# EAGLE design TRRSwithProMicro (EAGLE 9.1.0)
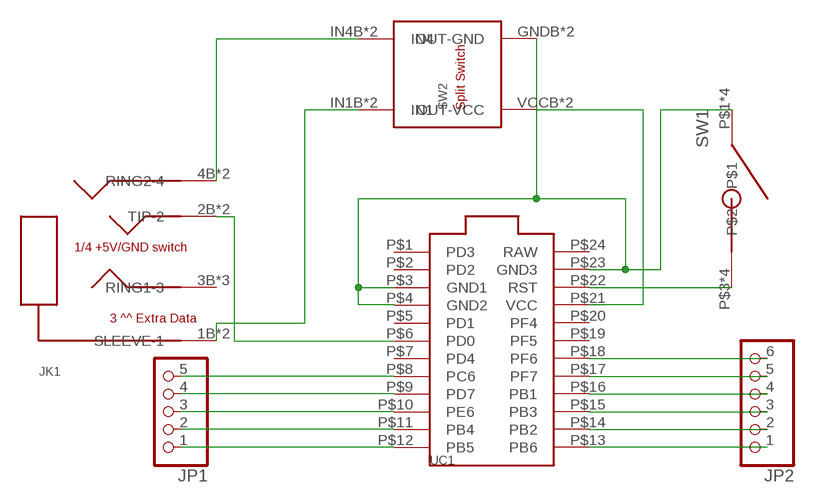
[diagram p0: schematic, sheet 1]

## Parts
JK1  TRRSJACKOVER  [TRRSJACK_OVER]
JP1  PINHD-1X5  [1X05]
JP2  PINHD-1X6  [1X06]
SW1  RSTSWSMD  [FLATSWT]
SW2  TRANSFERPADDY  [TRANSFER_PADS]
UC1  PROMICROTOP  [PROMICRO]

## Nets
N$1: JK1.1B(SLEEVE-1) JK1.1T(SLEEVE-1) SW2.IN1B(IN1) SW2.IN1T(IN1)
N$2: SW1.P$1 SW1.P$2 SW1.P$5 SW1.P$6 SW2.GNDB(OUT-GND) SW2.GNDT(OUT-GND) UC1.P$3(GND1) UC1.P$4(GND2) UC1.P$23(GND3)
N$3: JK1.2B(TIP-2) JK1.2T(TIP-2) UC1.P$6(PD0)
N$4: JK1.4B(RING2-4) JK1.4T(RING2-4) SW2.IN4B(IN4) SW2.IN4T(IN4)
N$5: SW1.P$3 SW1.P$4 SW1.P$7 SW1.P$8 UC1.P$22(RST)
N$6: JP1.1 UC1.P$12(PB5)
N$7: JP1.2 UC1.P$11(PB4)
N$8: JP1.3 UC1.P$10(PE6)
N$9: JP1.4 UC1.P$9(PD7)
N$10: JP2.1 UC1.P$13(PB6)
N$11: JP2.2 UC1.P$14(PB2)
N$12: JP2.3 UC1.P$15(PB3)
N$13: JP2.4 UC1.P$16(PB1)
N$14: JP2.5 UC1.P$17(PF7)
N$15: JP2.6 UC1.P$18(PF6)
N$16: JP1.5 UC1.P$8(PC6)
N$17: SW2.VCCB(OUT-VCC) SW2.VCCT(OUT-VCC) UC1.P$21(VCC)
Unconnected: JK1.3B(RING1-3) JK1.3T(RING1-3) JK1.EXTRA_DATA(RING1-3) UC1.P$1(PD3) UC1.P$2(PD2) UC1.P$5(PD1) UC1.P$7(PD4) UC1.P$19(PF5) UC1.P$20(PF4) UC1.P$24(RAW)

## Library data of the parts
JK1 = Keys:TRRSJACK
JP1 = pinhead:PINHD-1X5: PIN HEADER
JP2 = pinhead:PINHD-1X6: PIN HEADER
SW1 = Keys:RSTSW
SW2 = Keys:TRANSFER
UC1 = Keys:PROMICRO

## Board
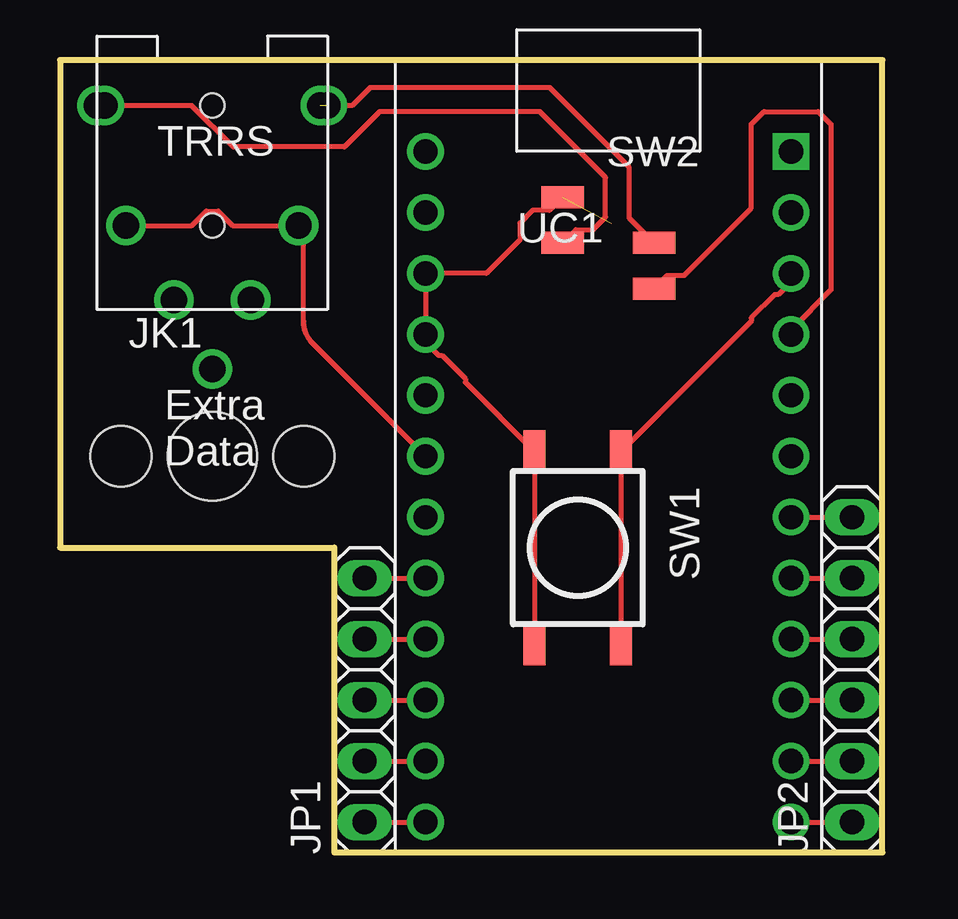
[diagram p1: board, top side]
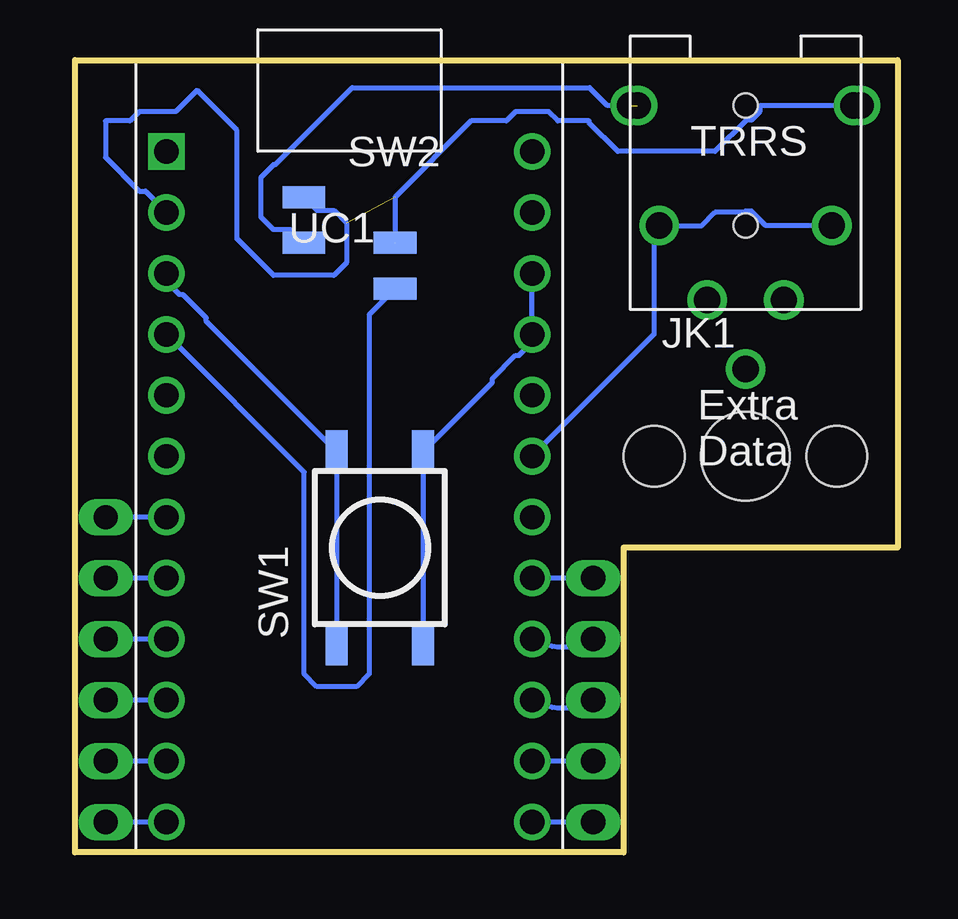
[diagram p2: board, bottom side, seen from below]

Size 34.29 x 33.02 mm. Coordinates in mm from the lower left corner, seen from the top.
Outline: 11.43,12.7 11.43,0 34.29,0 34.29,33.02 0,33.02 0,12.7 11.43,12.7
Copper layers (1*16): Top 0.035mm / dielectric 1.5mm / Bottom 0.035mm
Design rules "OthermillDRC_1_32_v2": minimum track width 8mil, minimum drill 0.8mm, track to track 0.794003125mm, track to pad 0.794003125mm, pad to pad 0.794003125mm, via to via 0.794003125mm, smd to smd 0mil, copper to edge 0mil, drill to drill 1mil, minimum pad ring 10mil, minimum via ring 10mil, stop-mask expansion 1mil, vias tented up to drill 30mil, thermal gap 10mil
Holes 3.71 mm at 6.35,16.51 -7.62,7.62
Holes 2.54 mm at 2.54,16.51 10.16,16.51

### Footprints (pad centres in the part's own frame; a part is rotated, then mirrored left to right if it is on the bottom)
TRRSJACK_OVER = drill 1.1: 1B 4.5,-1.9; 1T 4.8,-1.9; 2B 3.6,-6.9; 2T -3.6,-6.9; 3B -1.6,-10; 3T 1.6,-10; 4B -4.8,-1.9; 4T -4.5,-1.9; EXTRA_DATA 0,-12.87 | hole 1: 0,-1.9; 0,-6.9
1X05 = drill 1.016 long: 1 -5.08,0; 2 -2.54,0; 3 0,0; 4 2.54,0; 5 5.08,0
1X06 = drill 1.016 long: 1 -6.35,0; 2 -3.81,0; 3 -1.27,0; 4 1.27,0; 5 3.81,0; 6 6.35,0
FLATSWT = smd 1.778 x 0.914: P$1 -4,-1.8; P$2 4,-1.8; P$3 -4,1.8; P$4 4,1.8 | smd 1.778 x 0.914 bottom: P$5 -4,-1.8; P$6 4,-1.8; P$7 -4,1.8; P$8 4,1.8
TRANSFER_PADS = smd 1.778 x 0.914 bottom: GNDB -1.905,-1.905; IN1B -1.905,0; IN4B 1.905,0; VCCB 1.905,1.905 | smd 1.778 x 0.914: GNDT 1.905,-1.905; IN1T -1.905,0; IN4T 1.905,0; VCCT -1.905,1.905
PROMICRO = drill 1.016: P$1 -7.62,0; P$2 -7.62,-2.54; P$3 -7.62,-5.08; P$4 -7.62,-7.62; P$5 -7.62,-10.16; P$6 -7.62,-12.7; P$7 -7.62,-15.24; P$8 -7.62,-17.78; P$9 -7.62,-20.32; P$10 -7.62,-22.86; P$11 -7.62,-25.4; P$12 -7.62,-27.94; P$13 7.62,-27.94; P$14 7.62,-25.4; P$15 7.62,-22.86; P$16 7.62,-20.32; P$17 7.62,-17.78; P$18 7.62,-15.24; P$19 7.62,-12.7; P$20 7.62,-10.16; P$21 7.62,-7.62; P$22 7.62,-5.08; P$23 7.62,-2.54 | drill 1.016 square: P$24 7.62,0

### Placement (x,y rotation side)
JK1  6.35,33.02 0 top
JP1  12.7,6.35 90 top
JP2  33.02,7.62 90 top
SW1  21.59,12.7 270 top
SW2  22.86,25.4 180 top
UC1  22.86,29.21 0 top

### Tracks (layer width: path | path; a pad name or v marks a point on that pad's centre or on a via)
N$1  (1 unrouted)
  Top 0.203: SW2.IN1B 23.74,26.43 23.74,28.55 20.42,31.86 12.92,31.86 12.17,31.12 JK1.1T
  Bottom 0.203: SW2.IN1B 25.32,25.95 26.02,25.95 26.55,26.48 26.55,28.13 26.02,28.66 25.95,28.66 22.75,31.86 12.85,31.86 12.1,31.12 JK1.1T
N$2  (1 unrouted)
  Top 0.203: UC1.P$4 15.24,21.25 | 15.24,21.25 15.78,20.71 15.93,20.71 16.9,19.74 16.9,19.59 SW1.P$5 SW1.P$6 | SW2.GNDT 20.4,26.75 19.7,26.75 19.17,26.23 19.17,25.52 17.78,24.13 UC1.P$3 15.24,21.25
  Bottom 0.203: UC1.P$3 UC1.P$4 15.24,21.25 15.78,20.71 15.93,20.71 16.9,19.74 16.9,19.59 SW1.P$5 SW1.P$6 | SW2.GNDB 24.21,26.75 23.5,26.75 22.98,26.23 22.98,24.57 23.5,24.05 26.02,24.05 27.55,25.57 27.55,30.09 29.21,31.75 30.09,30.87 31.61,30.87 32,30.48 33.02,30.48 33.02,28.96 31.61,27.55 31.36,27.55 UC1.P$23
N$3
  Top 0.203: UC1.P$6 13.97,17.78 10.53,21.22 arc-45 10.16,22.12 10.16,25.61 arc45 JK1.2B 7.2,26.12 6.6,26.72 6.1,26.72 5.5,26.12 JK1.2T
  Bottom 0.203: 6.35,26.72 6.1,26.72 5.5,26.12 JK1.2T | UC1.P$6 13.97,17.78 10.16,21.59 10.16,25.91 JK1.2B 8.17,26.12 7.62,26.67 6.35,26.67
N$4  (1 unrouted)
  Top 0.203: JK1.4B 5.5,31.12 7.22,29.4 11.86,29.4 13.33,30.87 20,30.87 22.74,28.13 22.74,26.48 22.21,25.95 21.51,25.95 SW2.IN4T
  Bottom 0.203: JK1.4T 5.71,31.12 5.75,31.08 5.75,30.87 6.1,30.52 6.31,30.52 7.62,29.21 11.67,29.21 12.87,30.41 12.87,30.48 14.17,30.48 14.55,30.87 15.93,30.87 16.31,30.48 17.78,30.48 20.95,27.3 20.95,26.67 SW2.IN4T
N$5
  Top 0.203: UC1.P$22 30.48,23.79 29.94,23.25 29.79,23.25 28.82,22.28 28.82,22.13 SW1.P$7 SW1.P$8
  Bottom 0.203: SW1.P$8 SW1.P$7 28.82,22.13 28.82,22.28 29.79,23.25 29.94,23.25 30.48,23.79 UC1.P$22
N$6
  Top 0.203: JP1.1 UC1.P$12 JP1.1
  Bottom 0.203: JP1.1 UC1.P$12
N$7
  Top 0.203: JP1.2 UC1.P$11 JP1.2
  Bottom 0.203: JP1.2 UC1.P$11
N$8
  Top 0.203: JP1.3 UC1.P$10
  Bottom 0.203: JP1.3 arc60 UC1.P$10
N$9
  Top 0.203: JP1.4 UC1.P$9
  Bottom 0.203: 11.66,8.89 JP1.4 arc60 UC1.P$9
N$10
  Top 0.203: UC1.P$13 JP2.1 UC1.P$13
  Bottom 0.203: UC1.P$13 JP2.1
N$11
  Top 0.203: UC1.P$14 JP2.2 UC1.P$14
  Bottom 0.203: UC1.P$14 JP2.2
N$12
  Top 0.203: UC1.P$15 JP2.3 UC1.P$15
  Bottom 0.203: UC1.P$15 JP2.3
N$13
  Top 0.203: UC1.P$16 JP2.4 UC1.P$16
  Bottom 0.203: UC1.P$16 JP2.4
N$14
  Top 0.203: UC1.P$17 JP2.5 UC1.P$17
  Bottom 0.203: UC1.P$17 JP2.5
N$15
  Top 0.203: UC1.P$18 JP2.6 UC1.P$18
  Bottom 0.203: UC1.P$18 JP2.6
N$16
  Top 0.203: JP1.5 UC1.P$8
  Bottom 0.203: JP1.5 UC1.P$8
N$17
  Top 0.203: SW2.VCCT 25.32,24.05 26.02,24.05 28.82,26.84 28.82,30.34 29.35,30.87 31.61,30.87 32.14,30.34 32.14,23.44 30.48,21.79 UC1.P$21
  Bottom 0.203: UC1.P$21 24.74,15.85 24.74,7.44 24.22,6.92 22.56,6.92 22.04,7.44 22.04,22.41 SW2.VCCB